# Altium project R3S601.PrjPCB
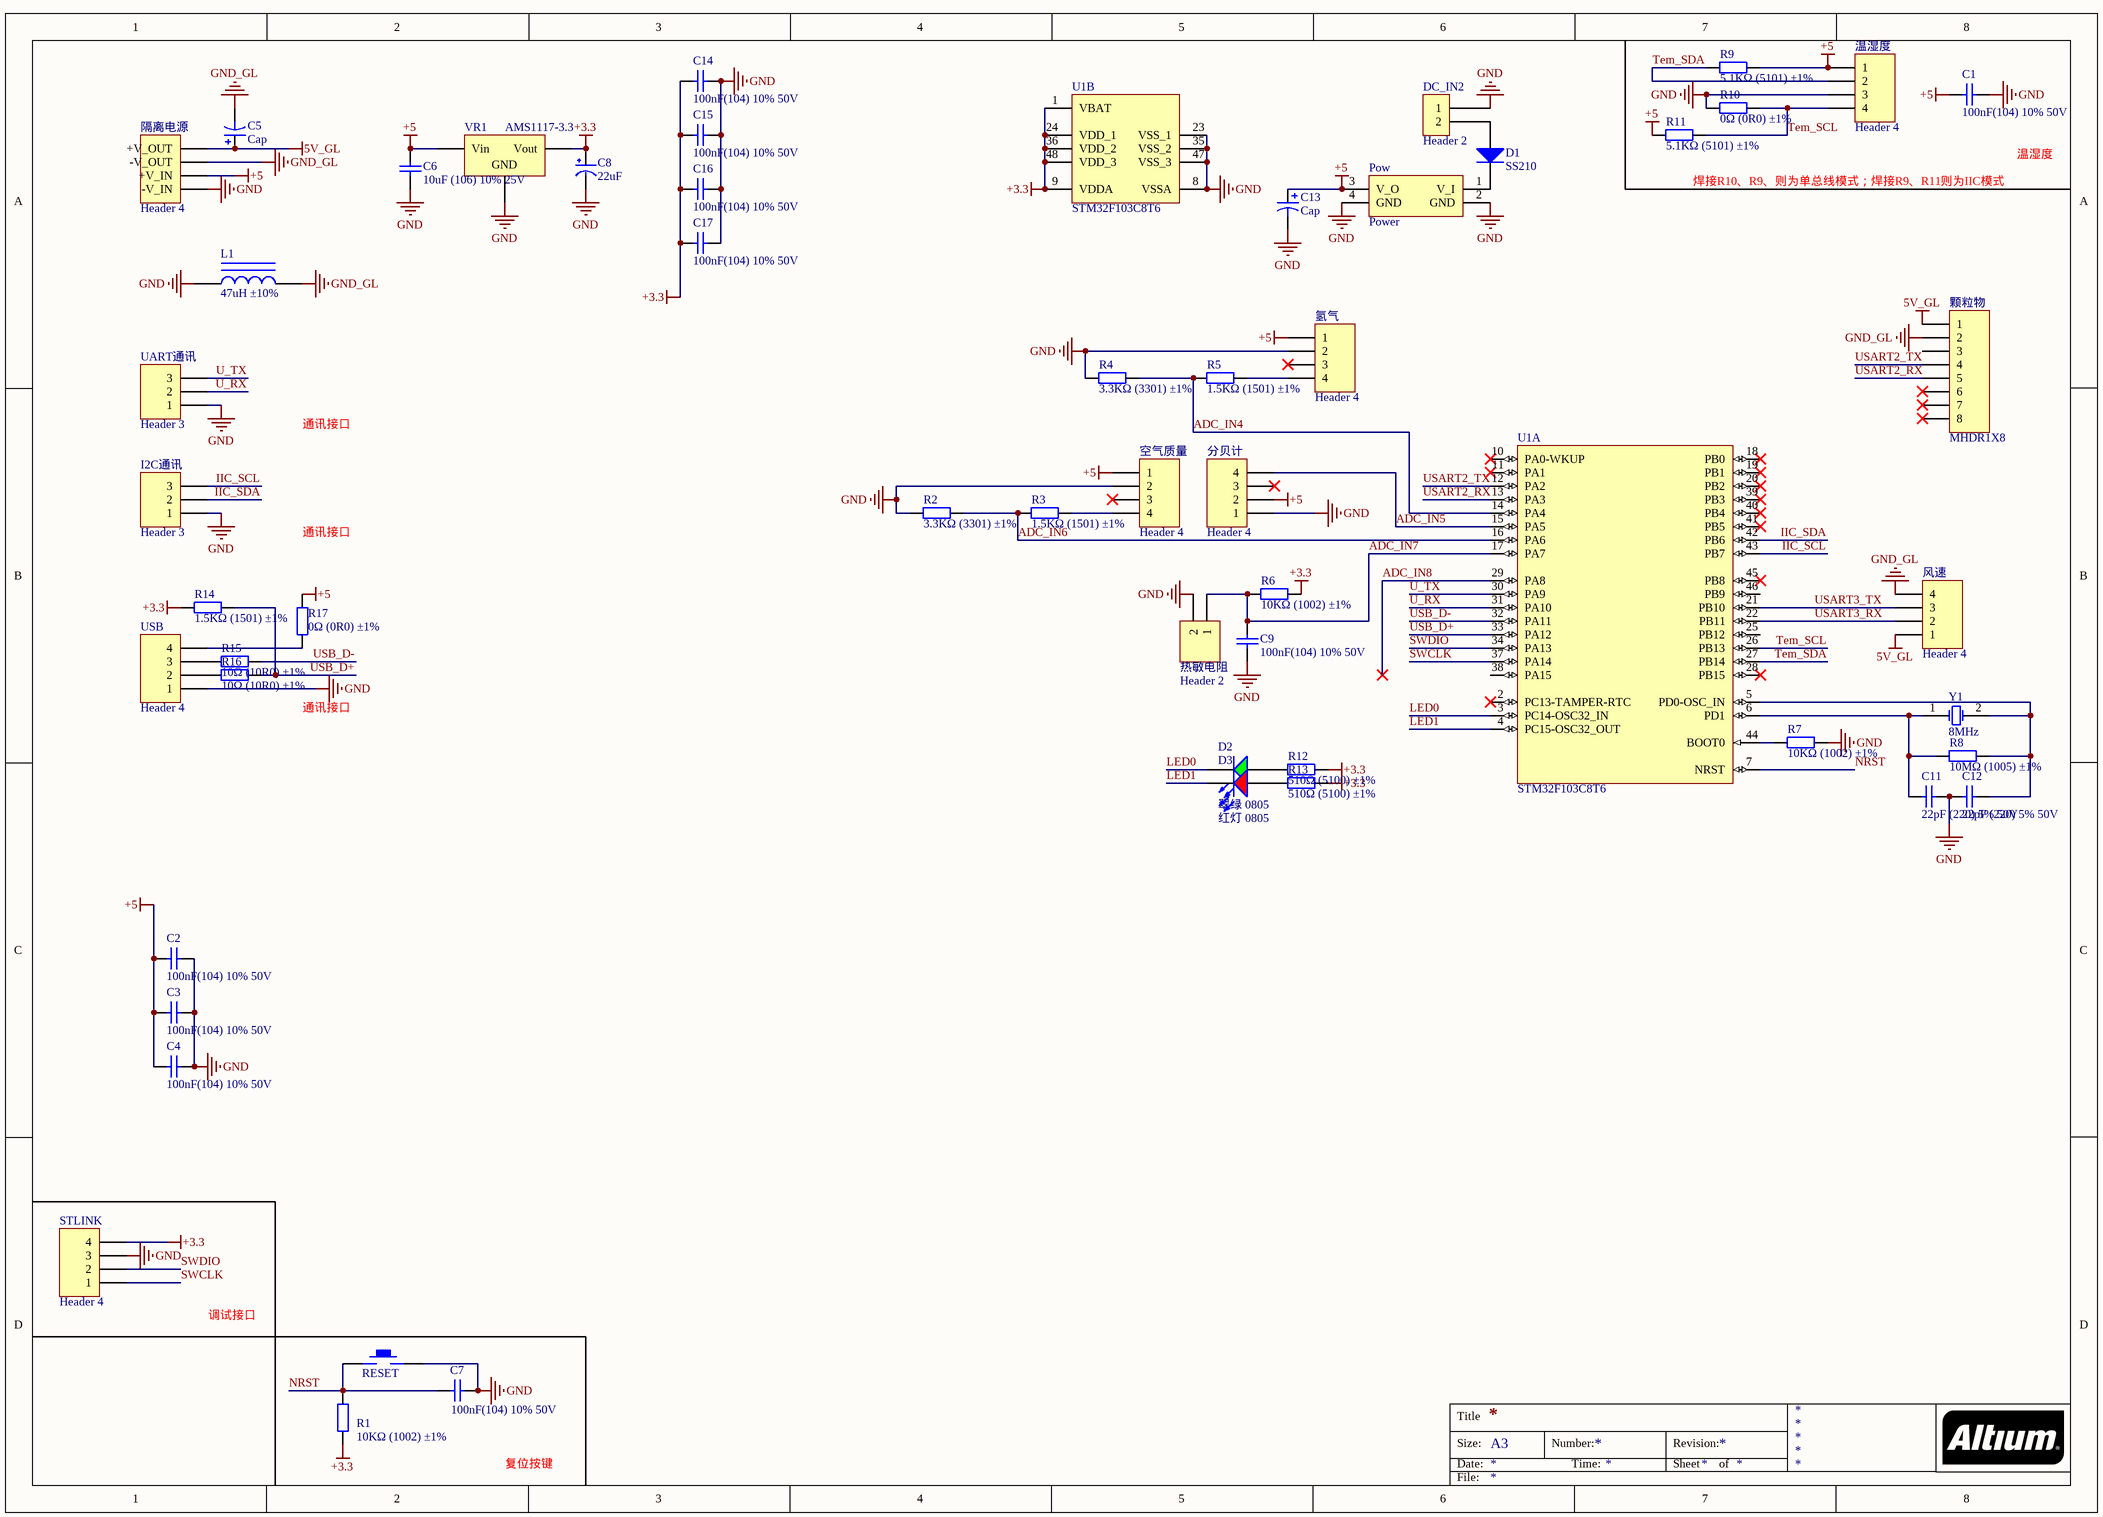
[diagram p0: R3S602.SchDoc]
1 sheet, 55 parts. Net scope: global (net labels, ports and power ports of the same name join across sheets).
Board file: R3S603.PcbDoc

## Sheet R3S602.SchDoc
size A3

### Parts
C1  100nF(104) 10% 50V  [LC-0805_C]
C2  100nF(104) 10% 50V  [LC-0805_C]
C3  100nF(104) 10% 50V  [LC-0805_C]
C4  100nF(104) 10% 50V  [LC-0805_C]
C5  Cap  [CAP-DIP-3.5]
C6  10uF (106) 10% 25V  [LC-0805_C]
C7  100nF(104) 10% 50V  [LC-0805_C]
C8  22uF  [CC6.56.5]
C9  100nF(104) 10% 50V  [LC-0805_C]
C11  22pF (220) 5% 50V  [LC-0805_C]
C12  22pF (220) 5% 50V  [LC-0805_C]
C13  Cap  [CAP-DIP-3.5]
C14  100nF(104) 10% 50V  [LC-0805_C]
C15  100nF(104) 10% 50V  [LC-0805_C]
C16  100nF(104) 10% 50V  [LC-0805_C]
C17  100nF(104) 10% 50V  [LC-0805_C]
D1  SS210  [LC-SMA(DO-214AC)_S1]
D2  翠绿 0805  [LC-0805_LED_S1]
D3  红灯 0805  [LC-0805_LED_S1]
DC_IN2  Header 2  [VH-2A - Circle Hole]
I2C通讯  Header 3  [HDR1X3]
L1  47uH ±10%  [LC-0805_L]
Pow  Power  [Power_Model]
R1  10KΩ (1002) ±1%  [LC-0805_R]
R2  3.3KΩ (3301) ±1%  [LC-0805_R]
R3  1.5KΩ (1501) ±1%  [LC-0805_R]
R4  3.3KΩ (3301) ±1%  [LC-0805_R]
R5  1.5KΩ (1501) ±1%  [LC-0805_R]
R6  10KΩ (1002) ±1%  [LC-0805_R]
R7  10KΩ (1002) ±1%  [LC-0805_R]
R8  10MΩ (1005) ±1%  [LC-0805_R]
R9  5.1KΩ (5101) ±1%  [LC-0805_R]
R10  0Ω (0R0) ±1%  [LC-0603_R]
R11  5.1KΩ (5101) ±1%  [LC-0805_R]
R12  510Ω (5100) ±1%  [LC-0805_R]
R13  510Ω (5100) ±1%  [LC-0805_R]
R14  1.5KΩ (1501) ±1%  [LC-0805_R]
R15  10Ω (10R0) ±1%  [LC-0805_R]
R16  10Ω (10R0) ±1%  [LC-0805_R]
R17  0Ω (0R0) ±1%  [LC-0603_R]
RESET  KEY_M  [KEY_M]  (value not drawn)
STLINK  Header 4  [HDR1X4]
U1  STM32F103C8T6  [LC-LQFP-48_7x7x05P]  (parts A,B of 2)
UART通讯  Header 3  [HDR1X3]
USB  Header 4  [HDR1X4]
VR1  AMS1117-3.3  [LC-SOT-223]
Y1  8MHz  [XTAL_US]
分贝计  Header 4  [HDR1X4]
氢气  Header 4  [HDR1X4]
温湿度  Header 4  [HDR1X4]
热敏电阻  Header 2  [HDR1X2]
空气质量  Header 4  [HDR1X4]
隔离电源  Header 4  [HDR1X4]
颗粒物  MHDR1X8  [MHDR1X8]
风速  Header 4  [HDR1X4]

### Nets
5V_GL: C5.1 隔离电源.4(+V_OUT) 颗粒物.1 风速.1
+3.3: C8.1(VCC) C14.2 C15.2 C16.2 C17.2 R1.1 R6.1 R12.2 R13.2 R14.2 STLINK.4 U1.1(VBAT) U1.9(VDDA) U1.24(VDD_1) U1.36(VDD_2) U1.48(VDD_3) VR1.2(Vout)
+5: C1.2 C2.1 C3.1 C4.1 C6.2 C13.1 Pow.3(V_O) R9.2 R11.1 R17.2 VR1.3(Vin) 分贝计.2 氢气.1 温湿度.1 空气质量.1 隔离电源.2(+V_IN)
GND: C1.1 C2.2 C3.2 C4.2 C6.1 C7.1 C8.2(GND) C9.1 C11.2 C12.1 C13.2 C14.1 C15.1 C16.1 C17.1 DC_IN2.1 I2C通讯.1 L1.1 Pow.2(GND) Pow.4(GND) R2.1 R4.1 R7.2 R10.1 RESET.2 STLINK.3 U1.8(VSSA) U1.23(VSS_1) U1.35(VSS_2) U1.47(VSS_3) UART通讯.1 USB.1 VR1.1(GND) 分贝计.1 氢气.2 温湿度.3 热敏电阻.2 空气质量.2 隔离电源.1(-V_IN)
GND_GL: C5.2 L1.2 隔离电源.3(-V_OUT) 颗粒物.2 风速.4
ADC_IN4: R4.2 R5.1 U1.14(PA4)
ADC_IN5: U1.15(PA5) 分贝计.4
ADC_IN6: R2.2 R3.1 U1.16(PA6)
ADC_IN7: C9.2 R6.2 U1.17(PA7) 热敏电阻.1
ADC_IN8: U1.29(PA8)
IIC_SCL: I2C通讯.3 U1.43(PB7)
IIC_SDA: I2C通讯.2 U1.42(PB6)
LED0: D2.K U1.3(PC14-OSC32_IN)
LED1: D3.K U1.4(PC15-OSC32_OUT)
NRST: C7.2 R1.2 RESET.1 U1.7(NRST)
SWCLK: STLINK.1 U1.37(PA14)
SWDIO: STLINK.2 U1.34(PA13)
Tem_SCL: R10.2 R11.2 U1.26(PB13) 温湿度.4
Tem_SDA: R9.1 U1.27(PB14) 温湿度.2
U_RX: U1.31(PA10) UART通讯.2
U_TX: U1.30(PA9) UART通讯.3
USART2_RX: U1.13(PA3) 颗粒物.5
USART2_TX: U1.12(PA2) 颗粒物.4
USART3_RX: U1.22(PB11) 风速.2
USART3_TX: U1.21(PB10) 风速.3
USB_D+: R14.1 R16.2 U1.33(PA12)
USB_D-: R15.2 U1.32(PA11)
NetC11_1: C11.1 R8.1 U1.6(PD1) Y1.1(OSC1)
NetC12_2: C12.2 R8.2 U1.5(PD0-OSC_IN) Y1.2(OSC2)
NetD1_1: D1.1(A) DC_IN2.2
NetD1_2: D1.2(K) Pow.1(V_I)
NetD2_A: D2.A R12.1
NetD3_A: D3.A R13.1
NetR3_2: R3.2 空气质量.4
NetR5_2: R5.2 氢气.4
NetR7_1: R7.1 U1.44(BOOT0)
NetR15_1: R15.1 USB.3
NetR16_1: R16.1 USB.2
NetR17_1: R17.1 USB.4

Not connected (* = marked no-connect by the designer): U1 2(PC13-TAMPER-RTC)* 10(PA0-WKUP)* 11(PA1)* 18(PB0)* 19(PB1)* 20(PB2)* 25(PB12) 28(PB15)* 38(PA15) 39(PB3)* 40(PB4)* 41(PB5)* 45(PB8)* 46(PB9); 分贝计 3*; 氢气 3*; 空气质量 3*; 颗粒物 3 6* 7* 8*

### Notes on the sheet
- (near R11) 焊接R10、R9、则为单总线模式；焊接R9、R11则为IIC模式
- 温湿度
- 通讯接口
- 调试接口
- 复位按键
- Title
- Size:
- Date:
- A3
- Number:
- Time:
- Revision:
- Sheet
- of
- File:

### Library data of the parts
C1-C4 C7 C9 C14-C17 = 0805 100nF(104) 10% 50V: 贴片电容; ComponentLink1Description: 供应商链接; ComponentLink1URL: http://www.szlcsc.com/product/details_50686.html; Package: 0805; Supplier: LC; SuppliersPartNumber: C49678
C5 C13 = Cap_DIP
C6 = 0805 10uF (106) 10% 25V: 贴片电容; ComponentLink1Description: 供应商链接; ComponentLink1URL: http://www.szlcsc.com/product/details_16532.html; Package: 0805; Supplier: LC; SuppliersPartNumber: C15850
C8 = CAP
C11 C12 = 0805 22pF (220) 5% 50V: 贴片电容; ComponentLink1Description: 供应商链接; ComponentLink1URL: http://www.szlcsc.com/product/details_2156.html; Package: 0805; Supplier: LC; SuppliersPartNumber: C1804
D1 = SMA(DO-214AC) SS210: 二极管; ComponentLink1Description: 供应商链接; ComponentLink1URL: http://www.szlcsc.com/product/details_15669.html; Package: SMA(DO-214AC); Supplier: LC; SuppliersPartNumber: C14996
D2 = 0805 翠绿: 发光二极管; ComponentLink1Description: 供应商链接; ComponentLink1URL: http://www.szlcsc.com/product/details_2670.html; Package: 0805; Supplier: LC; SuppliersPartNumber: C2297
D3 = 0805 红灯: 发光二极管; ComponentLink1Description: 供应商链接; ComponentLink1URL: http://www.szlcsc.com/product/details_2668.html; Package: 0805; Supplier: LC; SuppliersPartNumber: C2295
DC_IN2 = Header 2: 贴片2p座
I2C通讯 UART通讯 = Header 3: Header, 3-Pin; LatestRevisionDate: 17-Jul-2002; LatestRevisionNote: Re-released for DXP Platform.; Publisher: Altium Limited
L1 = 0805 47uH 10%: 贴片电感; ComponentLink1Description: 供应商链接; ComponentLink1URL: http://www.szlcsc.com/product/details_14964.html; Package: 0805; Supplier: LC; SuppliersPartNumber: C14304
Pow = Power_Model
R1 R6 R7 = 0805 10KΩ (1002) 1%: 贴片电阻; ComponentLink1Description: 供应商链接; ComponentLink1URL: http://www.szlcsc.com/product/details_18102.html; Package: 0805; Supplier: LC; SuppliersPartNumber: C17414
R2 R4 = 0805 3.3KΩ (3301) 1%: 贴片电阻; ComponentLink1Description: 供应商链接; ComponentLink1URL: http://www.szlcsc.com/product/details_26753.html; Package: 0805; Supplier: LC; SuppliersPartNumber: C26010
R3 R5 R14 = 0805 1.5KΩ (1501) 1%: 贴片电阻; ComponentLink1Description: 供应商链接; ComponentLink1URL: http://www.szlcsc.com/product/details_4717.html; Package: 0805; Supplier: LC; SuppliersPartNumber: C4310
R8 = 0805 10MΩ (1005) 1%: 贴片电阻; ComponentLink1Description: 供应商链接; ComponentLink1URL: http://www.szlcsc.com/product/details_26851.html; Package: 0805; Supplier: LC; SuppliersPartNumber: C26108
R9 R11 = 0805 5.1KΩ (5101) 1%: 贴片电阻; ComponentLink1Description: 供应商链接; ComponentLink1URL: http://www.szlcsc.com/product/details_28584.html; Package: 0805; Supplier: LC; SuppliersPartNumber: C27834
R10 R17 = 0603 0Ω (0R0) 1%: 贴片电阻; ComponentLink1Description: 供应商链接; ComponentLink1URL: http://www.szlcsc.com/product/details_21903.html; Package: 0603; Supplier: LC; SuppliersPartNumber: C21189
R12 R13 = 0805 510Ω (5100) 1%: 贴片电阻; ComponentLink1Description: 供应商链接; ComponentLink1URL: http://www.szlcsc.com/product/details_18422.html; Package: 0805; Supplier: LC; SuppliersPartNumber: C17734
R15 R16 = 0805 10Ω (10R0) 1%: 贴片电阻; ComponentLink1Description: 供应商链接; ComponentLink1URL: http://www.szlcsc.com/product/details_18103.html; Package: 0805; Supplier: LC; SuppliersPartNumber: C17415
STLINK USB 分贝计 氢气 温湿度 空气质量 隔离电源 风速 = Header 4: Header, 4-Pin; LatestRevisionDate: 17-Jul-2002; LatestRevisionNote: Re-released for DXP Platform.; Publisher: Altium Limited
U1 = STM32F103C8T6: ARM; ComponentLink1Description: 供应商链接; ComponentLink1URL: http://www.szlcsc.com/product/details_9243.html; Package: LQFP-48_7x7x05P; Supplier: LC; SuppliersPartNumber: C8734
VR1 = SOT-223 AMS1117-3.3: 低压差线性稳压(LDO); ComponentLink1Description: 供应商链接; ComponentLink1URL: http://www.szlcsc.com/product/details_6652.html; Package: SOT-223; Supplier: LC; SuppliersPartNumber: C6186
Y1 = XTAL: Crystal Oscillator; Published: 8-Jun-2000; LatestRevisionDate: 17-Jul-2002; LatestRevisionNote: Re-released for DXP Platform.; Publisher: Altium Limited
热敏电阻 = Header 2: Header, 2-Pin; LatestRevisionDate: 17-Jul-2002; LatestRevisionNote: Re-released for DXP Platform.; Publisher: Altium Limited
颗粒物 = MHDR1X8: Header, 8-Pin; LatestRevisionDate: 17-Jul-2002; LatestRevisionNote: Re-released for DXP Platform.; Publisher: Altium Limited